# EAGLE design 5vAC-DCCReg (EAGLE 9.6.2)
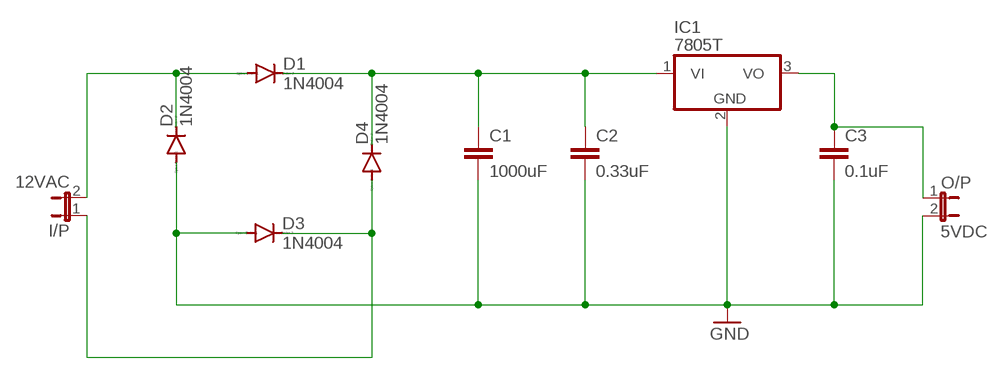
[diagram p0: schematic, sheet 1]

## Parts
C1  1000uF  C2,5-3  [C2.5-3]
C2  0.33uF  C2,5-3  [C2.5-3]
C3  0.1uF  C2,5-3  [C2.5-3]
D1  1N4004  [DO41-10]
D2  1N4004  [DO41-10]
D3  1N4004  [DO41-10]
D4  1N4004  [DO41-10]
I/P  12VAC  JP1E  [JP1]
IC1  7805T  [TO220H]
O/P  5VDC  JP1E  [JP1]

## Nets
GND: C1.2 C2.2 C3.2 D2.A D3.A IC1.2(GND) O/P.2
N$1: D1.A D2.C I/P.2
N$2: C1.1 C2.1 D1.C D4.C IC1.1(VI)
N$4: D3.C D4.A I/P.1
N$5: C3.1 IC1.3(VO) O/P.1

## Library data of the parts
C1-C3 = capacitor-wima:C: CAPACITOR naming: grid - package width
D1-D4 = diode:1N4004: DIODE general purpose rectifier, 1 A
I/P O/P = jumper:JP1E: JUMPER
IC1 = linear:78*: Positive VOLTAGE REGULATOR Source: http://cache.national.com/ds/LM/LM78L05.pdf http://www.fairchildsemi.com/ds/LM/LM7805.pdf

## Board
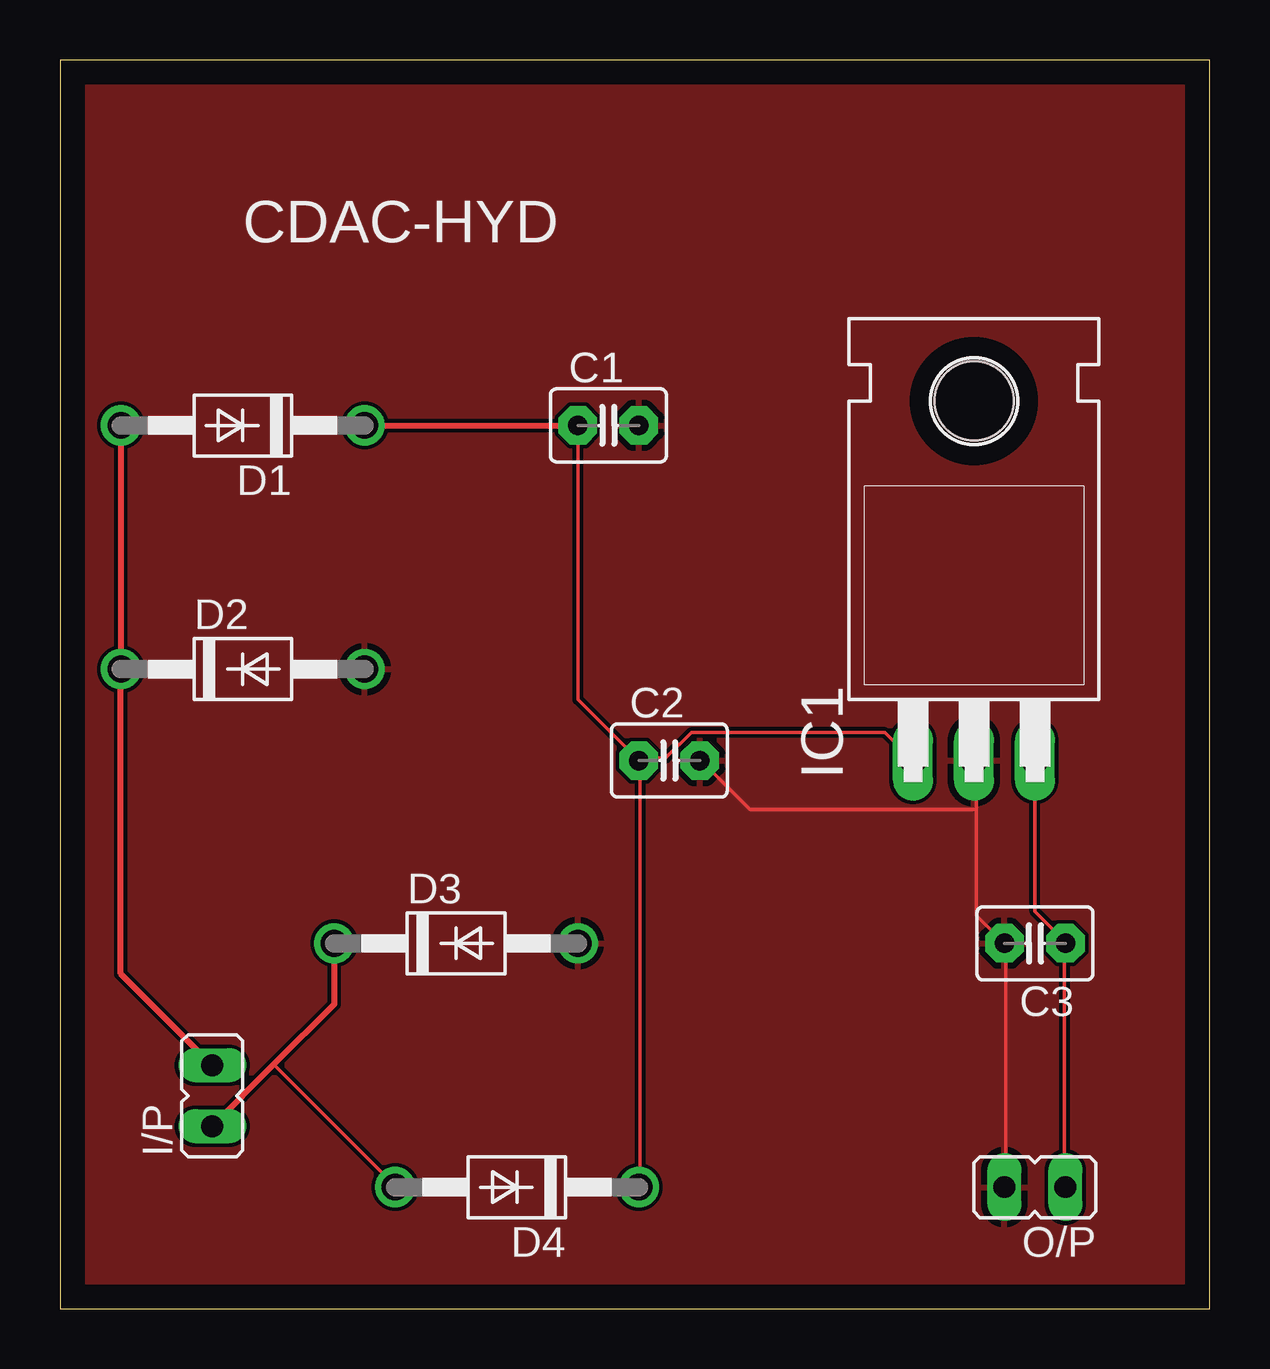
[diagram p1: board, top side]
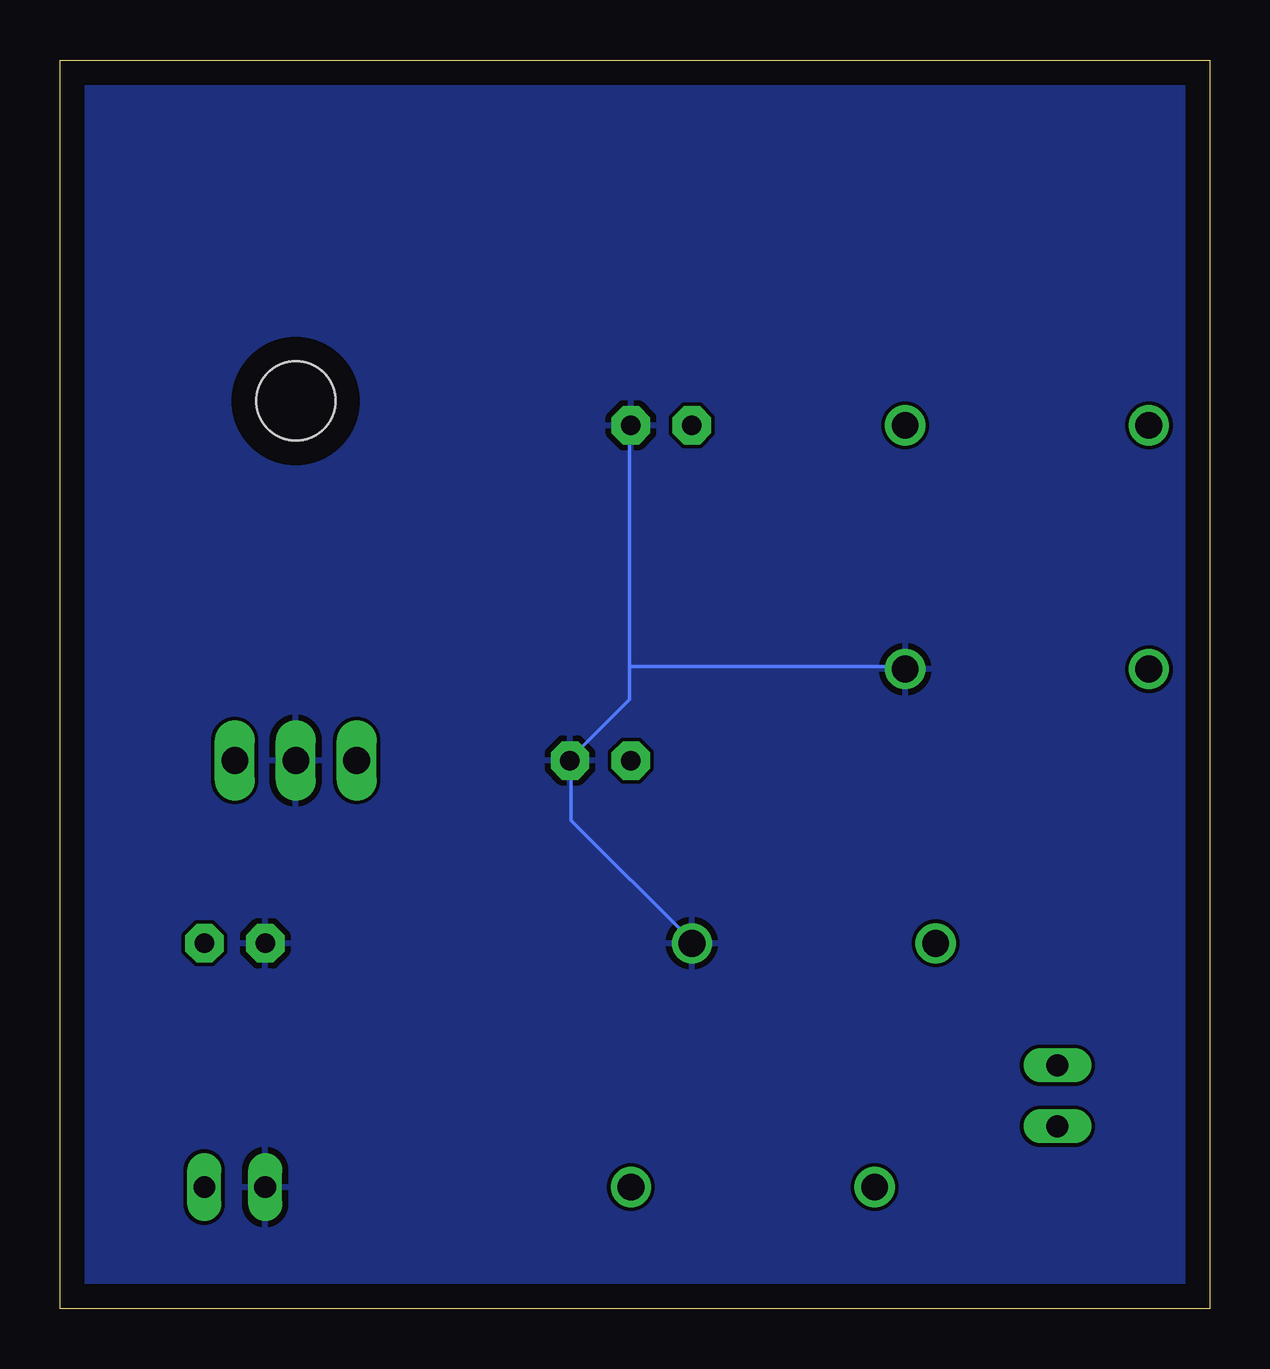
[diagram p2: board, bottom side, seen from below]

Size 47.93 x 52.06 mm. Coordinates in mm from the lower left corner, seen from the top.
Outline: 0,0 47.93,0 47.93,52.06 0,52.06 0,0
Copper layers (1*16): Top 0.035mm / dielectric 1.5mm / Bottom 0.035mm
Design rules "default": minimum track width 6mil, minimum drill 0.35mm, track to track 6mil, track to pad 6mil, pad to pad 6mil, via to via 6mil, smd to smd 6mil, copper to edge 40mil, drill to drill 6mil, minimum pad ring 10mil, minimum via ring 8mil, stop-mask expansion 4mil, vias tented up to drill 0mil, thermal gap 10mil

### Footprints (pad centres in the part's own frame; a part is rotated, then mirrored left to right if it is on the bottom)
C2.5-3 = drill 0.813 pad 1.6 octagon: 1 -1.27,0; 2 1.27,0
DO41-10 = drill 1.118: A 5.08,0; C -5.08,0
JP1 = drill 0.914 long: 1 0,-1.27; 2 0,1.27
TO220H = drill 1.118 long: 1 -2.54,-10.16; 2 0,-10.16; 3 2.54,-10.16 | hole 3.302: 0,4.826

### Placement (x,y rotation side)
C1  22.86,36.83 0 top
C2  25.4,22.86 0 top
C3  40.64,15.24 180 top
D1  7.62,36.83 180 top
D2  7.62,26.67 0 top
D3  16.51,15.24 0 top
D4  19.05,5.08 180 top
I/P  6.35,8.89 0 top
IC1  38.1,33.02 0 top
O/P  40.64,5.08 90 top

### Tracks (layer width: path | path; a pad name or v marks a point on that pad's centre or on a via)
GND
  Top 0.152: O/P.2 39.42,5.13 39.42,15.19 C3.2 38.2,16.41 38.2,20.83 | 38.2,20.83 38.2,22.81 IC1.2 | 38.2,20.83 28.75,20.83 26.77,22.81 C2.2
  Bottom 0.152: D3.A 21.59,15.34 26.62,20.37 26.62,22.81 C2.2 26.62,22.96 24.18,25.4 24.18,26.77 | 24.18,26.77 24.18,36.83 C1.2 | 24.18,26.77 12.75,26.77 D2.A
  pour Top: -2.54,53.34 53.34,53.34 53.34,-1.27 -2.54,-1.27
  pour Bottom: -1.27,55.88 55.88,55.88 58.42,53.34 58.42,-3.81 55.88,-6.35 -2.54,-6.35 -5.08,-3.81 -5.08,52.07
N$1
  Top 0.254: D1.A D2.C 2.54,13.97 I/P.2
N$2
  Top 0.152: IC1.1 34.39,24.03 26.31,24.03 25.25,22.96 24.18,22.96 C2.1 | D4.C 24.18,5.13 24.18,22.81 C2.1 | C1.1 21.59,25.4 C2.1
  Top 0.254: D1.C C1.1
N$4
  Top 0.152: 8.91,10.19 13.97,5.13 D4.A
  Top 0.254: D3.C 11.43,12.7 8.91,10.19 I/P.1
N$5
  Top 0.152: O/P.1 41.86,5.13 41.86,15.19 C3.1 41.86,15.34 40.64,16.56 IC1.3

### Text on the board
tPlace: CDAC-HYD